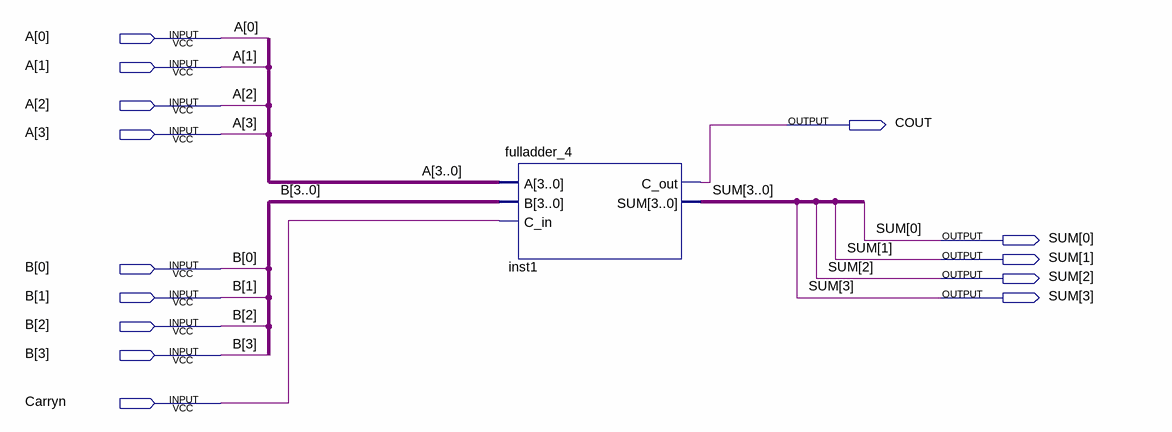
[diagram p0: schematic sheet]
// Quartus schematic Block2.bdf as structural Verilog: 1 symbols, 14 pins
module Block2 (
  input  [3:0] A,
  input  [3:0] B,
  input  Carryn,
  output COUT,
  output [3:0] SUM
);

  fulladder_4 inst1 (.A(A), .B(B), .C_in(Carryn), .C_out(COUT), .SUM(SUM));
endmodule
